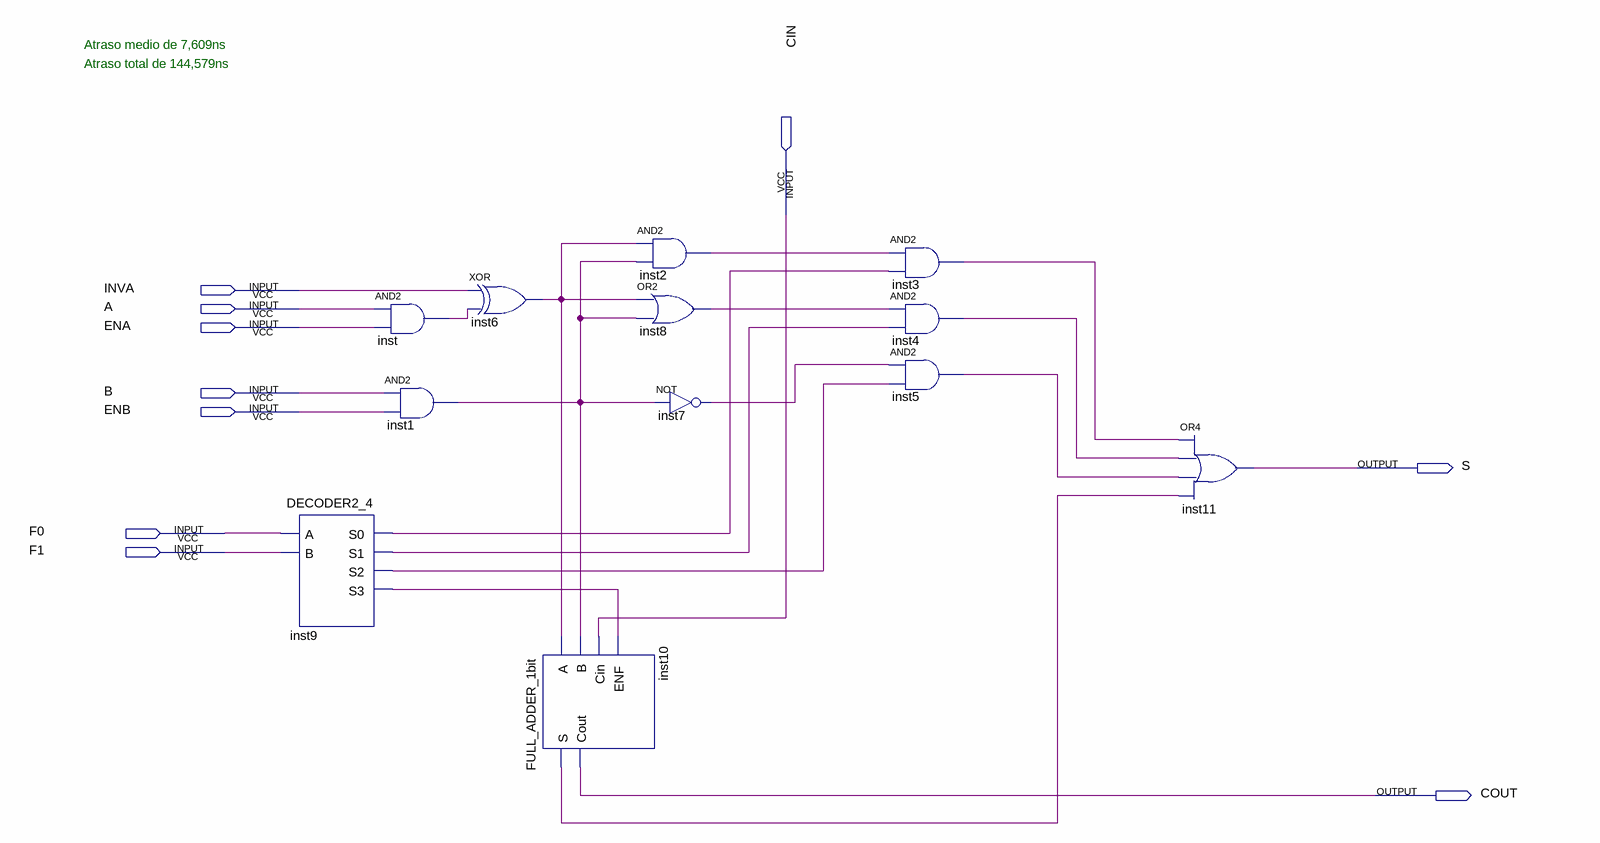
[diagram p0: schematic sheet]
// Quartus schematic ULA_1bit.bdf as structural Verilog: 12 symbols, 10 pins
module ULA_1bit (
  input  CIN,
  input  INVA,
  input  A,
  input  ENA,
  input  B,
  input  ENB,
  input  F0,
  input  F1,
  output S,
  output COUT
);

  wire inst1_out, inst2_out, inst3_out, inst4_out, inst5_out, inst6_out, inst7_out, inst8_out, inst9_s0,
       inst9_s1, inst9_s2, inst9_s3, inst10_s, inst_out;

  DECODER2_4 inst9 (.A(F0), .B(F1), .S0(inst9_s0), .S1(inst9_s1), .S2(inst9_s2), .S3(inst9_s3));
  and inst (inst_out, A, ENA);
  and inst1 (inst1_out, B, ENB);
  xor inst6 (inst6_out, INVA, inst_out);
  FULL_ADDER_1bit inst10 (.A(inst6_out), .B(inst1_out), .Cin(CIN), .ENF(inst9_s3), .S(inst10_s), .Cout(COUT));
  and inst2 (inst2_out, inst6_out, inst1_out);
  or inst8 (inst8_out, inst6_out, inst1_out);
  not inst7 (inst7_out, inst1_out);
  and inst3 (inst3_out, inst2_out, inst9_s0);
  and inst4 (inst4_out, inst8_out, inst9_s1);
  and inst5 (inst5_out, inst7_out, inst9_s2);
  or inst11 (S, inst3_out, inst4_out, inst5_out, inst10_s);

  // Notes on the sheet:
  //   Atraso medio de 7,609ns
  //   Atraso total de 144,579ns
endmodule
